# EAGLE design EMP-2 (EAGLE 5.11)
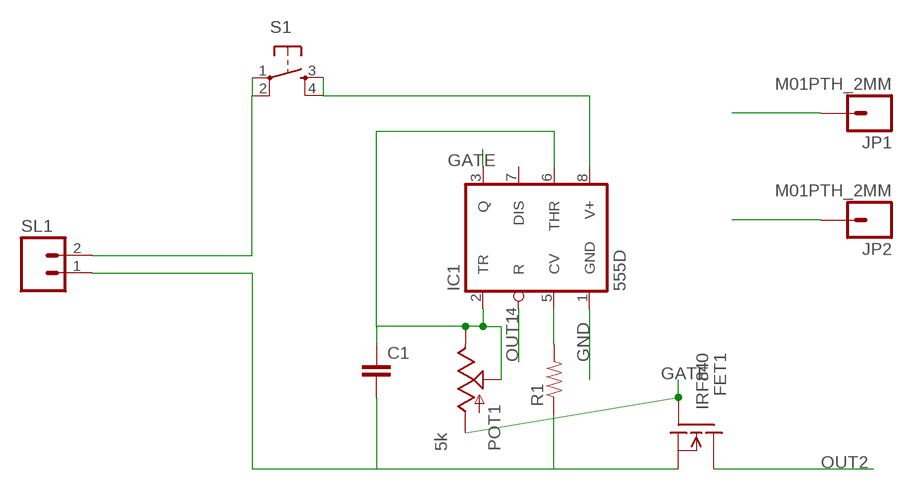
[diagram p0: schematic, sheet 1]

## Parts
C1  CAP0805  [0805]
FET1  IRF840  [TO220]
IC1  555D  [SO08]
JP1  M01PTH_2MM  [1X01_2MM]
JP2  M01PTH_2MM  [1X01_2MM]
POT1  5k  POT  [ALPS_POT]
R1  RESISTOR0805-RES  [0805]
S1  TAC_SWITCHPTH  [TACTILE-PTH]
SL1  M02  [02P]

## Nets
GATE: FET1.1(G) IC1.3(Q) POT1.P$3(A)
GND: C1.2 FET1.3(S) IC1.1(GND) R1.1 SL1.1
N$2: IC1.8(V+) S1.3 S1.4
N$3: IC1.5(CV) R1.2
N$4: C1.1 IC1.2(TR) IC1.6(THR) POT1.P$1(E) POT1.P$2(S)
OUT1: IC1.4(R) JP1.1
OUT2: FET1.2(D) JP2.1
VCC: S1.1 S1.2 SL1.2
Unconnected: IC1.7(DIS)

## Library data of the parts
C1 = SparkFun:CAP: Capacitor Standard 0603 ceramic capacitor, and 0.1" leaded capacitor.
FET1 = transistor-fet:IRF840: N-Channel Enhancement MOSFET (HEXFET); 500V; 8A; 0,85Ohm
IC1 = detector2:*555: TIMER
JP1 JP2 = SparkFun:M01: Header 1 Standard 1-pin 0.1" header. Use with straight break away headers (SKU : PRT-00116), right angle break away headers (PRT-00553), swiss pins (PRT-00743), machine pins (PRT-00117), and female headers (PRT-00115).
POT1 = SparkFun:POT
R1 = SparkFun:RESISTOR: Resistor Basic schematic elements and footprints for 0603, 1206, and PTH resistors.
S1 = SparkFun:TAC_SWITCH: Momentary Switch Button commonly used for reset or general input. Spark Fun Electronics SKU : COM-00097
SL1 = con-amp-quick:M02: AMP QUICK CONNECTOR; OC_FARNELL: unknown; OC_NEWARK: unknown

## Board
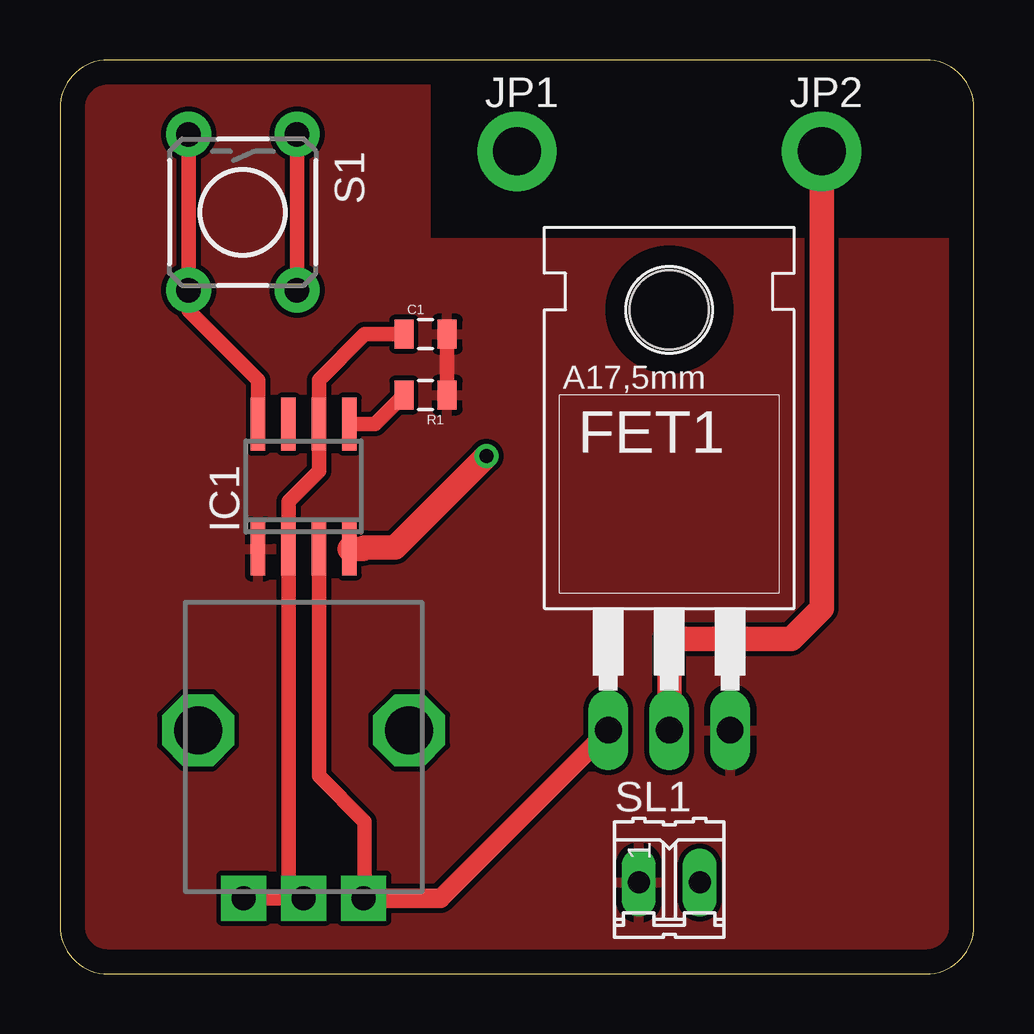
[diagram p1: board, top side]
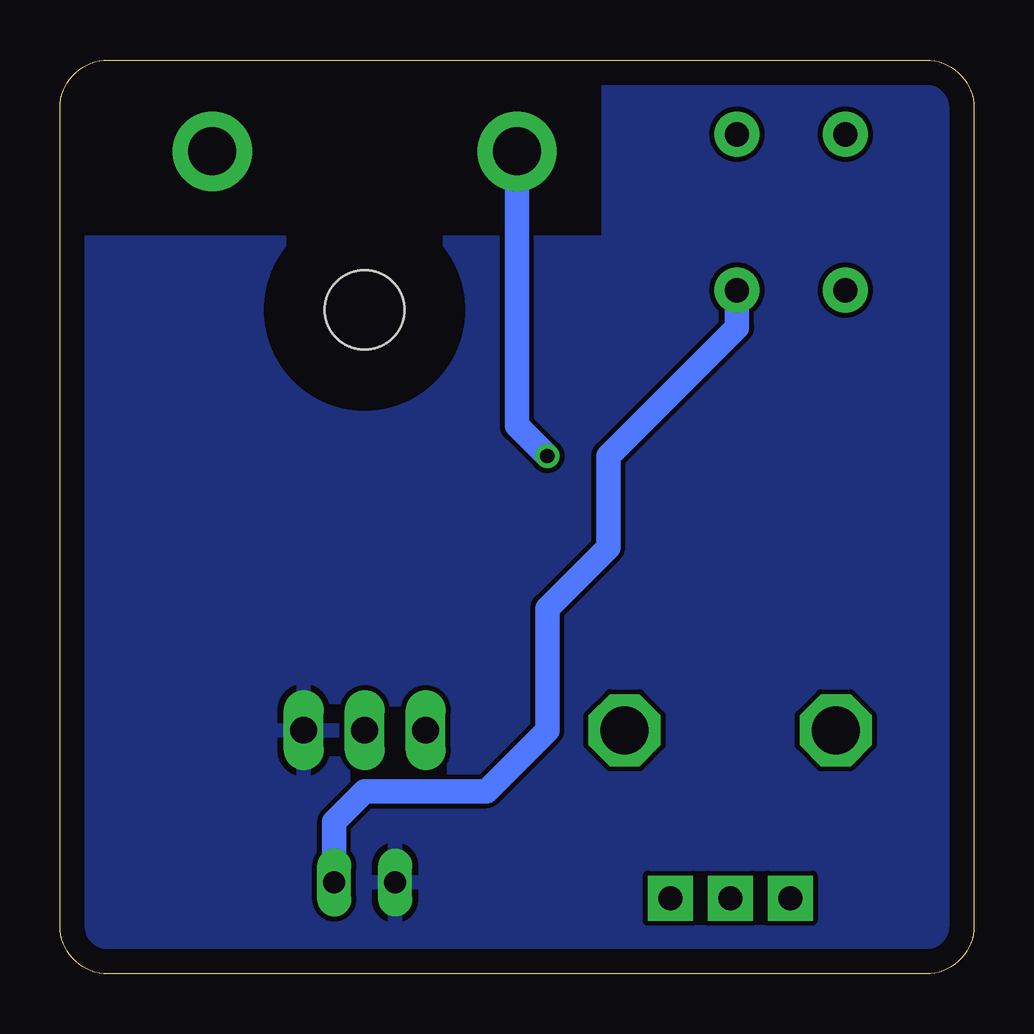
[diagram p2: board, bottom side, seen from below]

Size 38.1 x 38.1 mm. Coordinates in mm from the lower left corner, seen from the top.
Outline: 36.1,0 arc90 38.1,2 38.1,36.1 arc90 36.1,38.1 2,38.1 arc90 0,36.1 0,2 arc90 2,0 36.1,0
Copper layers (1*16): Top 0.035mm / dielectric 1.5mm / Bottom 0.035mm
Design rules "default": minimum track width 10mil, minimum drill 24mil, track to track 8mil, track to pad 8mil, pad to pad 8mil, via to via 8mil, smd to smd 8mil, copper to edge 40mil, drill to drill 8mil, minimum pad ring 10mil, minimum via ring 8mil, stop-mask expansion 4mil, vias tented up to drill 0mil, thermal gap 10mil

### Footprints (pad centres in the part's own frame; a part is rotated, then mirrored left to right if it is on the bottom)
0805 = smd 0.8 x 1.2: 1 -0.9,0; 2 0.9,0
TO220 = drill 1.118 long: 1 -2.54,-6.35; 2 0,-6.35; 3 2.54,-6.35 | hole 3.302: 0,11.176
SO08 = smd 0.6 x 2.2: 1 -1.905,-2.6; 2 -0.635,-2.6; 3 0.635,-2.6; 4 1.905,-2.6; 5 1.905,2.6; 6 0.635,2.6; 7 -0.635,2.6; 8 -1.905,2.6
1X01_2MM = drill 2 pad 3.302 round: 1 0,0
ALPS_POT = drill 1 pad 1.88 square: P$1 7,-2.5; P$2 7,0; P$3 7,2.5 | drill 2 octagon: P$4 0,-4.4; P$5 0,4.4
TACTILE-PTH = drill 1.016 pad 1.88 round: 1 -3.251,2.261; 2 3.251,2.261; 3 -3.251,-2.261; 4 3.251,-2.261
02P = drill 0.914 long: 1 -1.27,0; 2 1.27,0

### Placement (x,y rotation side)
C1  15.24,26.67 0 top
FET1  25.4,16.51 0 top
IC1  10.16,20.32 0 top
JP1  19.05,34.29 0 top
JP2  31.75,34.29 0 top
POT1  10.16,10.16 270 top
R1  15.24,24.13 180 top
S1  7.62,31.75 270 top
SL1  25.4,3.81 0 top

### Tracks (layer width: path | path; a pad name or v marks a point on that pad's centre or on a via)
GATE
  Top 0.61: IC1.3 10.79,8.26 12.7,6.35 12.7,3.2 POT1.P$3
  Top 0.813: POT1.P$3 15.86,3.16 FET1.1
GND
  Top 0.61: R1.1 C1.2
  pour Top: 15.24,38.1 15.24,30.48 38.1,30.48 38.1,2 arc-90 36.1,0 2,0 arc-90 0,2 0,36.1 arc-90 2,38.1
  pour Bottom: 0,38.1 0,0 38.1,0 38.1,30.48 15.24,30.48 15.24,38.1
N$2
  Top 0.61: S1.3 S1.4 5.36,27.94 | IC1.8 8.26,24.77 6.35,26.67 5.36,27.66 | 5.36,27.66 5.36,27.94 | 5.36,27.66 5.36,27.94
N$3
  Top 0.61: IC1.5 13.13,22.92 R1.2
N$4
  Top 0.61: C1.1 12.7,26.67 10.79,24.77 IC1.6 10.79,20.95 10.16,20.32 9.53,19.68 IC1.2 9.53,3.79 POT1.P$2 POT1.P$1
OUT1  (via drill 0.6)
  Top 1.016: v17.78,21.59 13.97,17.78 12.7,17.78 12.64,17.72 IC1.4
  Bottom 1.016: JP1.1 19.05,22.86 v17.78,21.59
OUT2
  Top 1.016: FET1.2 25.4,13.97 30.48,13.97 31.75,15.24 JP2.1
VCC
  Top 0.61: S1.2 S1.1
  Bottom 1.016: 9.88,28.22 S1.2 9.88,26.95 15.24,21.59 15.24,17.78 17.78,15.24 17.78,10.16 20.32,7.62 25.4,7.62 26.67,6.35 SL1.2